# EAGLE design BRD171031 (EAGLE 8.2.2)
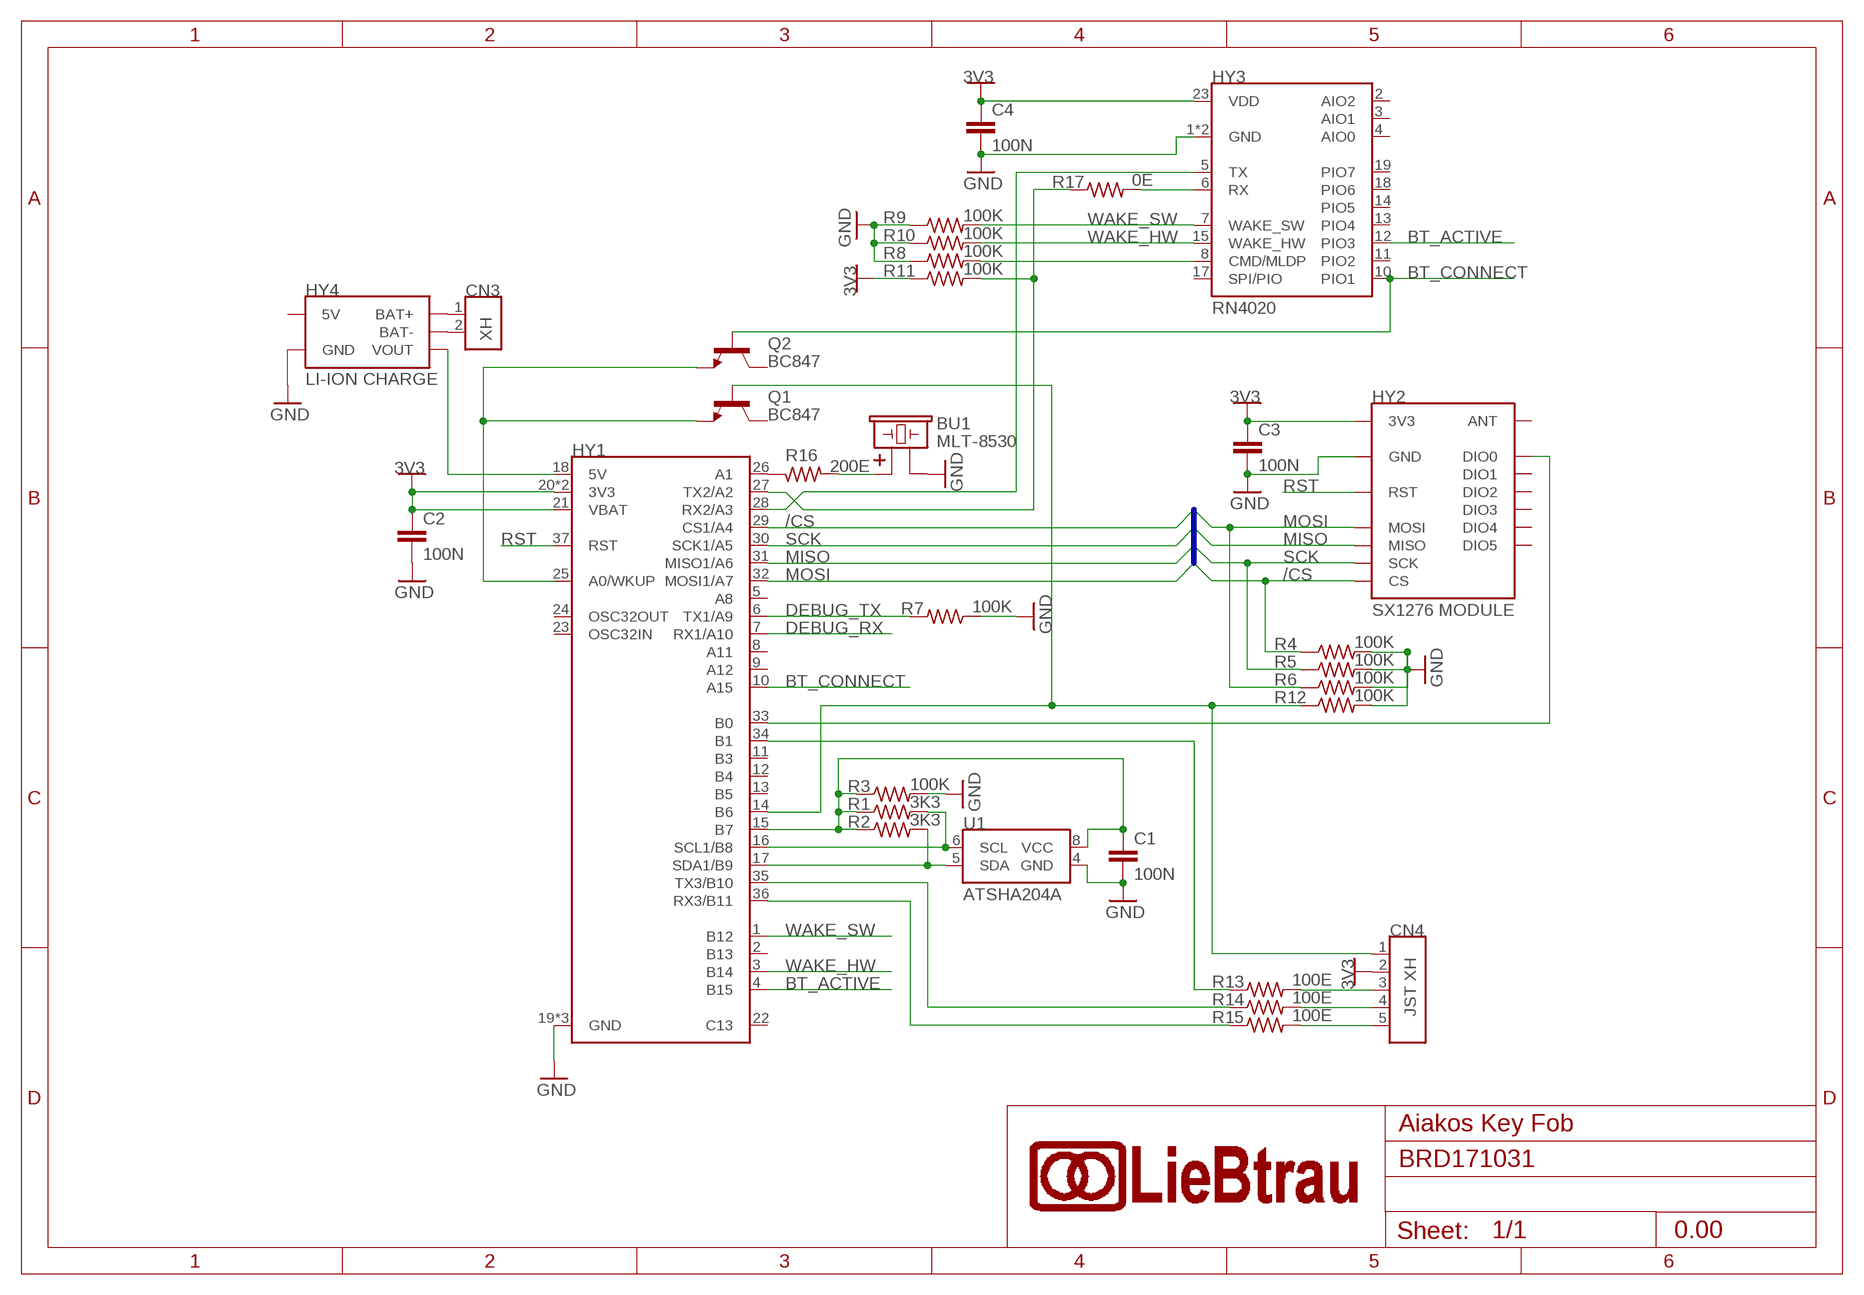
[diagram p0: schematic, sheet 1]
U$1 (SY_FRAMEA4): REV: 0.00; TITLE: Aiakos Key Fob

## Parts
BU1  MLT-8530  BU_B2P_8530_8530  [BU_8530]
C1  100N  CA_100N_1206  [CA_1206]
C2  100N  CA_100N_1206  [CA_1206]
C3  100N  CA_100N_1206  [CA_1206]
C4  100N  CA_100N_1206  [CA_1206]
CN3  XH  CN_2P_JST_B2B-XH_JST_B2B-XH  [CN_HDR_1X2_180D_P25_JST_B2B-XH]
CN4  JST XH  CN_5P_JST_B5B-XH_JST_B5B-XH  [CN_HDR_1X5_180D_P25_JST_B5B-XH]
HY1  HY_DEVBRD_BLUEPILL  [HY_DEVBRD_BLUEPILL_SMD]
HY2  SX1276 MODULE  HY_SX1276  [HY_SX1276]
HY3  RN4020  HY_RF_BLE_RN4020  [HY_BLE_RN4020]
HY4  LI-ION CHARGE  HY_PMMOD_LIION_TP4056__TP4056_  [HY_PMMOD_LIION]
Q1  BC847  TR_NPN_BC847_SOT23  [SC_SOT23]
Q2  BC847  TR_NPN_BC847_SOT23  [SC_SOT23]
R1  3K3  RE_3K3_1206  [RE_1206]
R2  3K3  RE_3K3_1206  [RE_1206]
R3  100K  RE_100K_1206  [RE_1206]
R4  100K  RE_100K_1206  [RE_1206]
R5  100K  RE_100K_1206  [RE_1206]
R6  100K  RE_100K_1206  [RE_1206]
R7  100K  RE_100K_1206  [RE_1206]
R8  100K  RE_100K_1206  [RE_1206]
R9  100K  RE_100K_1206  [RE_1206]
R10  100K  RE_100K_1206  [RE_1206]
R11  100K  RE_100K_1206  [RE_1206]
R12  100K  RE_100K_1206  [RE_1206]
R13  100E  RE_100E_1206  [RE_1206]
R14  100E  RE_100E_1206  [RE_1206]
R15  100E  RE_100E_1206  [RE_1206]
R16  200E  RE_200E_1206  [RE_1206]
R17  0E  RE_0E_1206  [RE_1206]
U1  ATSHA204A  IC_SPEC_ATSHA204A_ATSHA204A__SO8  [SC_SO08]

## Nets
3V3: C2.1 C3.1 C4.1 CN4.2 HY1.20(3V3) HY1.21(VBAT) HY1.38(3V3) HY2.VCC(3V3) HY3.23(VDD) R11.1
/CS: HY1.29(CS1/A4) HY2.NSS(CS) R4.1
BT_ACTIVE: HY1.4(B15) HY3.12(PIO3)
BT_CONNECT: HY1.10(A15) HY3.10(PIO1) Q2.1(B)
BTN: CN4.1 HY1.14(B6) Q1.1(B) R12.1
DEBUG_RX: HY1.7(RX1/A10)
DEBUG_TX: HY1.6(TX1/A9) R7.2
GND: BU1.2 C1.2 C2.2 C3.2 C4.2 HY1.19(GND) HY1.39(GND) HY1.40(GND) HY2.GND HY2.GND@1(GND) HY2.GND@2(GND) HY3.1(GND) HY3.24(GND) HY4.GND1(GND) HY4.GND2(GND) R3.2 R4.2 R5.2 R6.2 R7.1 R8.1 R9.1 R10.1 R12.2 U1.4(GND)
MISO: HY1.31(MISO1/A6) HY2.MISO
MOSI: HY1.32(MOSI1/A7) HY2.MOSI R6.1
N$1: HY3.6(RX) R17.2
N$4: HY1.33(B0) HY2.DIO0
N$5: HY1.27(TX2/A2) R11.2 R17.1
N$7: HY1.28(RX2/A3) HY3.5(TX)
N$9: HY3.8(CMD/MLDP) R8.2
N$10: HY1.36(RX3/B11) R15.1
N$11: HY1.35(TX3/B10) R14.1
N$12: HY1.34(B1) R13.1
N$14: HY1.25(A0/WKUP) Q1.2(E) Q2.2(E)
N$15: HY1.26(A1) R16.1
N$16: CN4.3 R13.2
N$17: CN4.4 R14.2
N$18: CN4.5 R15.2
N$19: BU1.1 R16.2
N$20: HY1.18(5V) HY4.OUT+(VOUT)
N$21: CN3.1 HY4.B+(BAT+)
N$22: CN3.2 HY4.B-(BAT-)
PWR_U1: C1.1 HY1.15(B7) R1.1 R2.1 R3.1 U1.8(VCC)
RST: HY1.37(RST) HY2.REST(RST)
SCK: HY1.30(SCK1/A5) HY2.SCK R5.1
SCL: HY1.16(SCL1/B8) R1.2 U1.6(SCL)
SDA: HY1.17(SDA1/B9) R2.2 U1.5(SDA)
WAKE_HW: HY1.3(B14) HY3.15(WAKE_HW) R10.2
WAKE_SW: HY1.1(B12) HY3.7(WAKE_SW) R9.2
Unconnected: HY1.2(B13) HY1.5(A8) HY1.8(A11) HY1.9(A12) HY1.11(B3) HY1.12(B4) HY1.13(B5) HY1.22(C13) HY1.23(OSC32IN) HY1.24(OSC32OUT) HY2.ANT HY2.DIO1 HY2.DIO2 HY2.DIO3 HY2.DIO4 HY2.DIO5 HY3.2(AIO2) HY3.3(AIO1) HY3.4(AIO0) HY3.11(PIO2) HY3.13(PIO4) HY3.14(PIO5) HY3.17(SPI/PIO) HY3.18(PIO6) HY3.19(PIO7) HY4.5V Q1.3(C) Q2.3(C)

## Buses
/CS,SCK,MISO,MOSI

## Library data of the parts
BU1 = lieBtrau:BU_B2P; COST: 2.29; ORDERCODE: 668-1479-1-ND
C1-C4 = lieBtrau:CA; COST: 0.09; ORDERCODE: 399-1249-1-ND
CN3 = lieBtrau:CN_2P; COST: 0.13; ORDERCODE: 455-2247-ND
CN4 = lieBtrau:CN_5P; COST: 0.21; ORDERCODE: 455-2270-ND
HY1 = lieBtrau:HY_DEVBRD_BLUEPILL
HY2 = lieBtrau:HY_SX1276: Order from AliExpress <https://www.aliexpress.com/item/2-pcs-LOra-Spreading-High-Sensitivity-XL1276-D01-XS1278-Wireless-Transceiver-Module-433MHz/32322666735.html>; COST: 7.28; ORDERCODE: AliExpress
HY3 = lieBtrau:HY_RF_BLE_RN4020; COST: 8.57; ORDERCODE: RN4020-V/RM123-ND
HY4 = lieBtrau:HY_PMMOD_LIION; COST: 0.28; ORDERCODE: AliExpress
Q1 Q2 = lieBtrau:TR_NPN; COST: 0.12; ORDERCODE: 568-1636-1-ND
R1 R2 = lieBtrau:RE: Yageo RC1206 Stackpole RMCF1206; COST: 0.09; ORDERCODE: 311-3.30KFRCT-ND
R3-R12 = lieBtrau:RE: Yageo RC1206 Stackpole RMCF1206; COST: 0.09; ORDERCODE: 311-100KFRCT-ND
R13-R15 = lieBtrau:RE: Yageo RC1206 Stackpole RMCF1206; COST: 0.09; ORDERCODE: 311-100FRCT-ND
R16 = lieBtrau:RE: Yageo RC1206 Stackpole RMCF1206; COST: 0.09; ORDERCODE: 311-200FRCT-ND
R17 = lieBtrau:RE: Yageo RC1206 Stackpole RMCF1206; COST: 0.09; ORDERCODE: 311-0.0ERCT-ND
U1 = lieBtrau:IC_SPEC_ATSHA204A; COST: 0.49; ORDERCODE: ATSHA204A-SSHDA-TCT-ND

## Board
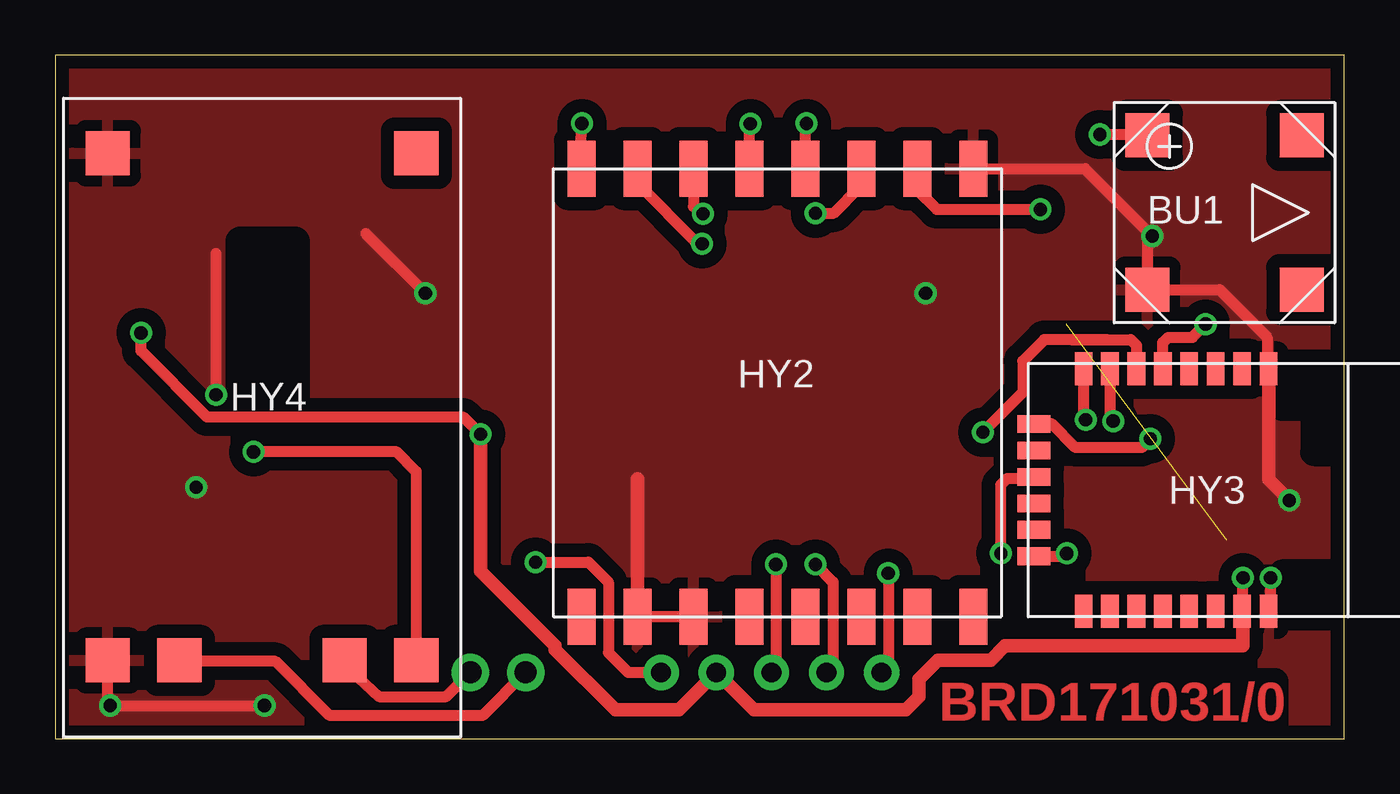
[diagram p1: board, top side]
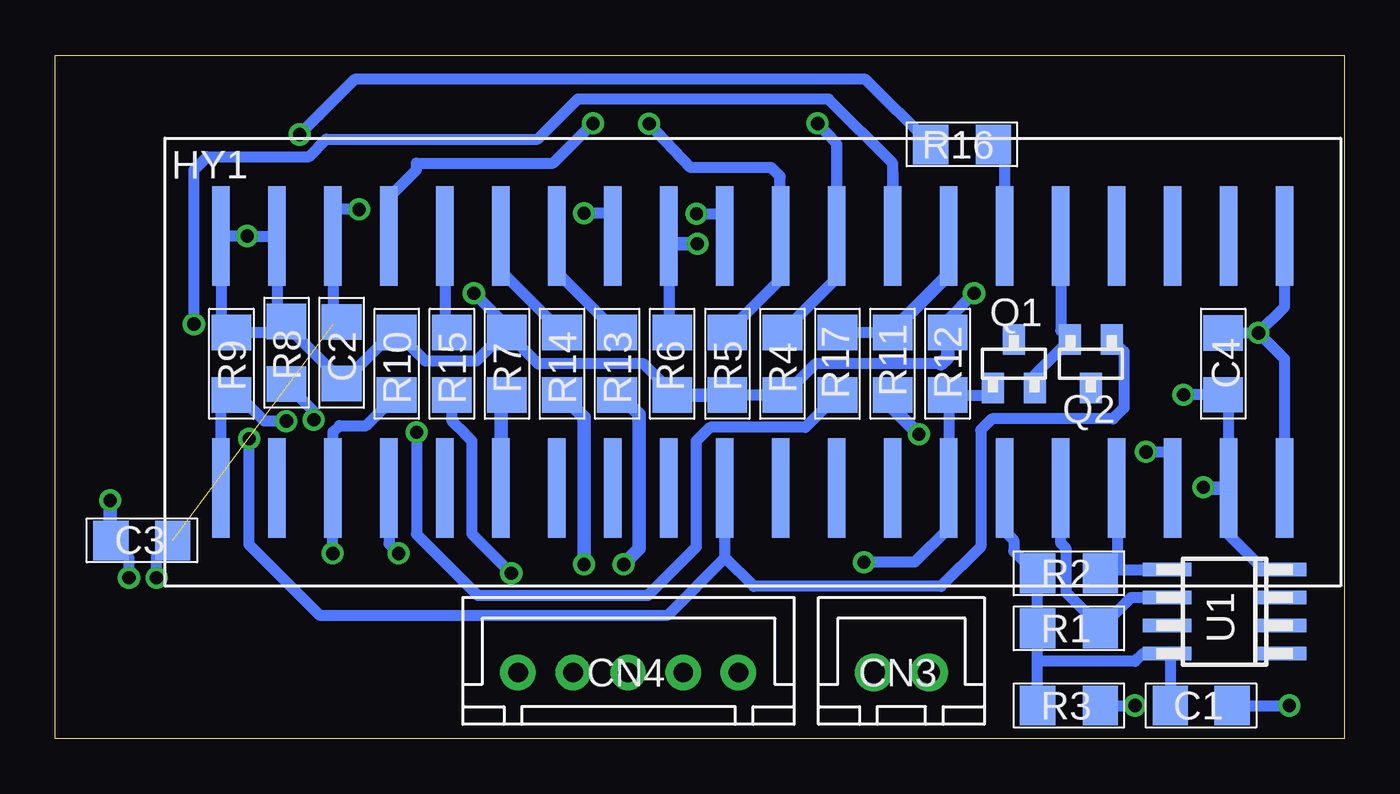
[diagram p2: board, bottom side, seen from below]

Size 58.5 x 31 mm. Coordinates in mm from the lower left corner, seen from the top.
Outline: 0,0 58.5,0 58.5,31 0,31 0,0
Copper layers (1*16): Top 0.035mm / dielectric 1.5mm / Bottom 0.035mm
Design rules "dtron": minimum track width 0.175mm, minimum drill 0.6mm, track to track 0.25mm, track to pad 0.25mm, pad to pad 0.2mm, via to via 0.25mm, smd to smd 0.2mm, copper to edge 0.5mm, drill to drill 0.2mm, minimum pad ring 0.25mm, minimum via ring 0.2mm, stop-mask expansion 0.1mm, vias tented up to drill 0mil, thermal gap 0.5mm

### Footprints (pad centres in the part's own frame; a part is rotated, then mirrored left to right if it is on the bottom)
BU_8530 = smd 2 x 2: 1 -3.5,3.5; 2 -3.5,-3.5; 3 3.5,-3.5; 4 3.5,3.5
CA_1206 = smd 1.6 x 1.8: 1 -1.4,0; 2 1.4,0
CN_HDR_1X2_180D_P25_JST_B2B-XH = drill 1 pad 1.7: 1 -1.25,0; 2 1.25,0
CN_HDR_1X5_180D_P25_JST_B5B-XH = drill 0.9 pad 1.6: 1 -5,0; 2 -2.5,0; 3 0,0; 4 2.5,0; 5 5,0
HY_DEVBRD_BLUEPILL_SMD = smd 4.5 x 0.8: 1 -5.715,20.32; 2 -5.715,17.78; 3 -5.715,15.24; 4 -5.715,12.7; 5 -5.715,10.16; 6 -5.715,7.62; 7 -5.715,5.08; 8 -5.715,2.54; 9 -5.715,0; 10 -5.715,-2.54; 11 -5.715,-5.08; 12 -5.715,-7.62; 13 -5.715,-10.16; 14 -5.715,-12.7; 15 -5.715,-15.24; 16 -5.715,-17.78; 17 -5.715,-20.32; 18 -5.715,-22.86; 19 -5.715,-25.4; 20 -5.715,-27.94; 21 5.715,-27.94; 22 5.715,-25.4; 23 5.715,-22.86; 24 5.715,-20.32; 25 5.715,-17.78; 26 5.715,-15.24; 27 5.715,-12.7; 28 5.715,-10.16; 29 5.715,-7.62; 30 5.715,-5.08; 31 5.715,-2.54; 32 5.715,0; 33 5.715,2.54; 34 5.715,5.08; 35 5.715,7.62; 36 5.715,10.16; 37 5.715,12.7; 38 5.715,15.24; 39 5.715,17.78; 40 5.715,20.32
HY_SX1276 = smd 2.54 x 1.27: ANT -10.16,8.89; DIO0 10.16,-3.81; DIO1 -10.16,1.27; DIO2 -10.16,-1.27; DIO3 -10.16,-3.81; DIO4 -10.16,-6.35; DIO5 -10.16,-8.89; GND 10.16,-8.89; GND@1 -10.16,6.35; GND@2 -10.16,3.81; MISO 10.16,3.81; MOSI 10.16,6.35; NSS 10.16,8.89; REST 10.16,-1.27; SCK 10.16,1.27; VCC 10.16,-6.35
HY_BLE_RN4020 = smd 1.5 x 0.8: 1 0.25,10.9; 2 0.25,9.7; 3 0.25,8.5; 4 0.25,7.3; 5 0.25,6.1; 6 0.25,4.9; 7 0.25,3.7; 8 0.25,2.5; 17 11.25,2.5; 18 11.25,3.7; 19 11.25,4.9; 20 11.25,6.1; 21 11.25,7.3; 22 11.25,8.5; 23 11.25,9.7; 24 11.25,10.9 | smd 0.8 x 1.5: 10 2.75,0.25; 11 3.95,0.25; 12 5.15,0.25; 13 6.35,0.25; 14 7.55,0.25; 15 8.75,0.25
HY_PMMOD_LIION = smd 2 x 2: 5V -12,6.5; B+ 11,3.25; B- 11,-4.25; GND1 -12,-7.5; GND2 11,-7.5; OUT+ 11,6.5
SC_SOT23 = smd 1 x 1.4: 1 -0.95,-1.1; 2 0.95,-1.1; 3 0,1.1
RE_1206 = smd 1.6 x 1.803: 1 -1.422,0; 2 1.422,0
SC_SO08 = smd 0.6 x 2.2: 1 -1.905,-2.6; 2 -0.635,-2.6; 3 0.635,-2.6; 4 1.905,-2.6; 5 1.905,2.6; 6 0.635,2.6; 7 -0.635,2.6; 8 -1.905,2.6

### Placement (x,y rotation side)
BU1  53.06,23.86 0 top
C1  6.5,1.5 0 bottom
C2  45.5,17.5 270 bottom
C3  54.56,8.99 180 bottom
C4  5.5,17 270 bottom
CN3  20.1,3 180 bottom
CN4  32.5,3 180 bottom
HY1  30.65,17.08 90 bottom
HY2  32.77,15.69 90 top
HY3  44.16,17.02 270 top
HY4  9.89,14.55 270 top
Q1  15,17 0 bottom
Q2  11.5,17 180 bottom
R1  12.5,5 0 bottom
R2  12.5,7.5 0 bottom
R3  12.5,1.5 0 bottom
R4  25.5,17 270 bottom
R5  28,17 270 bottom
R6  30.5,17 270 bottom
R7  38,17 270 bottom
R8  48,17.5 270 bottom
R9  50.5,17 270 bottom
R10  43,17 270 bottom
R11  20.5,17 90 bottom
R12  18,17 90 bottom
R13  33,17 270 bottom
R14  35.5,17 270 bottom
R15  40.5,17 270 bottom
R16  17.35,26.95 180 bottom
R17  23,17 270 bottom
U1  5.44,5.76 90 bottom
U$2  [MC_FRAME_A5]  -65.11,-59.3 0 top  (outside the outline)

### Tracks (layer width: path | path; a pad name or v marks a point on that pad's centre or on a via)
3V3  (via drill 0.6)  (1 unrouted)
  Top 0.508: v3.9,18.4 3.9,17.58 6.88,14.6 18.5,14.6 v19.3,13.8 | HY2.VCC 39.12,24.88 40,24 v44.7,24 | HY3.23 53.9,5.81 v53.9,7.3 | 30.15,3.15 CN4.2
  Top 0.61: v19.3,13.8 19.3,7.6 22.69,4.21 22.69,4.03 25.42,1.3 28.3,1.3 CN4.2 31.7,1.3 38.6,1.3 39.2,1.9 39.2,2.69 40.05,3.54 40.05,3.55 | 53.9,5.81 53.9,4.2 43.1,4.2 42.45,3.55 40.5,3.55 | 40.5,3.55 40.05,3.55 | 40.5,3.55 40.05,3.55
  Bottom 0.508: HY1.20 2.71,17.21 v3.9,18.4 | C4.1 v3.9,18.4 | v3.9,18.4 2.71,19.59 HY1.21 | C2.1 arc90 45.89,18.79 HY1.38 45.9,22.8 45.9,24 v44.7,24 | v53.9,7.3 53.9,8.25 C3.1
  Bottom 0.61: R11.1 20.5,15 v19.3,13.8
/CS  (via drill 0.6)
  Top 0.508: 24,26.5 24,25.97 HY2.NSS arc90 23.73,26 v23.9,27.9
  Bottom 0.508: v23.9,27.9 23.03,26.97 HY1.29 23.03,20.89 R4.1
BT_ACTIVE  (via drill 0.6)
  Top 0.508: v42.91,8.4 42.91,11.51 43.2,11.8 44.34,11.8 HY3.12
  Bottom 0.508: HY1.4 43.35,8.84 v42.91,8.4
BT_CONNECT  (via drill 0.6)
  Top 0.508: v49.7,13.6 49.3,13.2 46.3,13.2 45.23,14.27 HY3.10
  Bottom 0.508: Q2.1 10,17.55 10,15 10.5,14.5 16,14.5 16.5,14 16.5,8.7 18.3,6.9 26.8,6.9 28.1,8.2 | 28.1,8.2 HY1.10 | 28.1,8.2 30.7,5.6 46.5,5.6 49.7,8.8 v49.7,13.6
BTN  (via drill 0.6)
  Top 0.508: CN4.1 26,3 25.1,3.9 25.1,7.1 24.2,8 v21.8,8
  Bottom 0.508: Q1.1 16.27,15.58 R12.1 17.95,15.53 HY1.14 17.95,9.55 19.5,8 v21.8,8
DEBUG_TX
  Bottom 0.508: R7.2 38.27,15.31
  Bottom 0.61: 38.27,15.31 HY1.6
GND  (via drill 0.6)
  Top 0.508: HY4.GND2 2.39,1.61 v2.5,1.5 v9.5,1.5 | HY2.GND@2 HY2.GND@1 | v7.3,15.6 7.3,22 | 14.1,22.9 v16.8,20.2 | HY3.1 55,16.83 55,18.2 52.84,20.36 BU1.2 49.56,22.8 v49.78,22.8 46.73,25.85 HY2.GND | HY3.24 55.15,5.86 v55.15,7.3
  Top 0.61: HY2.GND@1 26.42,11.78 | HY3.1 55.06,11.74 v56,10.8
  Bottom 0.508: U1.4 3.66,7.67 5.25,9.25 HY1.19 5.25,15.35 arc-90 C4.2 v7.3,15.6 | R3.2 v9.5,1.5 | C1.2 v2.5,1.5 | R12.2 18,19 v16.8,20.2 | R8.1 48.43,18.85 HY1.39 v49.78,22.8 HY1.40 50.97,18.89 R9.1 48.5,18.42 R8.1 | 45.6,15.6 C2.2 45.44,16.16 | R6.2 30.5,15.7 31.8,17 36.58,17 R7.1 | R7.1 38.09,18.42 39.39,17.12 41.7,17.12 R10.1 43,18.3 43.3,18.3 45.44,16.16 | C3.2 55.15,8.18 v55.15,7.3 | 18.3,17 24,17 25.42,15.58 R5.2 | R8.1 48,18.72 45.44,16.16 | R7.1 38,18.7 v39.5,20.2
  Bottom 0.61: R12.2 18,17.3 18.3,17 | R5.2 R6.2 | R4.2 25.42,15.58 | HY1.19 6.27,11.37 v6.4,11.4 | v56,10.8 56,9.03 C3.2
  pour Top (isolate 0.61): -3.1,32.1 -3.1,-3.7 68.1,-3.7 68.1,32.1
MISO  (via drill 0.6)
  Top 0.508: HY2.MISO 28.96,24.14 v29.4,23.8
  Bottom 0.508: v29.4,23.8 28.3,23.8 28.1,22.8 HY1.31
MOSI  (via drill 0.6)
  Top 0.508: v29.36,22.45 29.15,22.45 26.42,25.18 HY2.MOSI
  Bottom 0.508: R6.1 30.65,18.42 30.65,22.48 HY1.32
  Bottom 0.61: v29.36,22.45 30.62,22.45 30.65,22.48
N$1  (via drill 0.6)
  Top 0.508: HY3.6 49.06,17.84 48.8,18.1 46.6,18.1 | 46.1,18.1 46.6,18.1 | v42.1,13.9 43.91,15.71 43.91,17.12 44.88,18.1 46.6,18.1 | 47.7,18.1 46.6,18.1
  Bottom 0.508: R17.2 24.46,14.12 28.78,14.12 29.4,13.5 29.4,8.7 31.6,6.5 39.33,6.5 42.1,9.27 v42.1,13.9
N$4  (via drill 0.6)
  Top 0.508: v34.5,23.83 35.33,23.83 36.5,25 36.5,25.77 HY2.DIO0
  Bottom 0.508: HY1.33 33.19,23.83 v34.5,23.83
N$5
  Bottom 0.508: R17.1 R11.2
  Bottom 0.61: R11.2 20.5,18.5 17.95,21.05 HY1.27
N$7  (via drill 0.6)
  Top 0.508: HY3.5 50.26,17.96 50.5,18.2 51.6,18.2 v52.2,18.8
  Bottom 0.508: 20.49,25.69 HY1.28 20.49,26.09 23.4,29 34.79,29 36.6,27.19 46.19,27.19 46.98,26.4 51.6,26.4 52.2,25.8 v52.2,18.8
N$9  (via drill 0.6)
  Top 0.508: HY3.8 46.66,14.56 v46.76,14.46
  Bottom 0.508: v46.76,14.46 46.76,14.84 R8.2
N$10
  Bottom 0.508: HY1.36 40.81,18.42 R15.1
N$11
  Bottom 0.508: R14.1 38.27,21.19 HY1.35
N$12
  Bottom 0.508: HY1.34 35.73,21.15 R13.1
N$14
  Bottom 0.508: Q1.2 14.05,16.5 Q2.2 | Q2.2 | HY1.25 12.87,18.51 Q2.2
N$15
  Bottom 0.508: HY1.26 15.41,26.95 R16.1
N$16  (via drill 0.6)
  Top 0.508: v32.7,7.9 32.7,3.2
  Top 0.61: 32.7,3.2 CN4.3
  Bottom 0.61: R13.2 32.88,15.58 32,14.7 32,8.6 v32.7,7.9
N$17  (via drill 0.6)
  Top 0.508: v34.5,7.9 35.3,7.1 35.3,3.3 CN4.4
  Top 0.61: CN4.4 35.3,3.3
  Bottom 0.61: R14.2 34.5,14.58 v34.5,7.9
N$18  (via drill 0.6)
  Top 0.508: v37.8,7.5 37.8,3.3 CN4.5
  Bottom 0.508: R15.2 40.5,14.42 39.91,13.82 39.91,13.81 39.6,13.5 39.6,9.3 v37.8,7.5
N$19  (via drill 0.6)
  Top 0.508: v47.4,27.4 49.52,27.4 BU1.1
  Bottom 0.508: 46.55,28.25 v47.4,27.4 44.9,29.9 21.72,29.9 R16.2
N$20  (via drill 0.6)
  Top 0.508: HY4.OUT+ 16.39,12.11 15.5,13 v9,13
  Bottom 0.508: v9,13 8,13 7.79,12.79 HY1.18
N$21
  Top 0.508: HY4.B+ 13.14,3.36 14.7,1.9 17.75,1.9 CN3.1
N$22
  Top 0.508: CN3.2 19.39,1.04 12.46,1.04 10,3.5 5.69,3.5 HY4.B-
PWR_U1
  Bottom 0.508: C1.1 7.9,3.71 U1.8 9.14,3.85 9.5,3.5 13.8,3.5 13.92,3.38 | HY1.15 15.41,9.41 15,9 15,8.5 13.92,7.42 R1.1 13.92,3.38 | R3.1 13.92,3.38
  Bottom 0.61: R2.1 13.92,7.42
RST  (via drill 0.6)
  Top 0.508: HY2.REST 34.04,27.75 v34.09,27.9
  Bottom 0.508: HY1.37 43.35,24.55 42.1,25.8 42.1,26.1 35.9,26.1 v34.09,27.9
SCK  (via drill 0.6)
  Top 0.508: 31.17,26.18 HY2.SCK 31.5,27.74 v31.55,27.88
  Bottom 0.508: HY1.30 25.6,22.82 | R5.1 25.6,20.82 25.6,22.82 | v31.55,27.88 29.66,25.9 26,25.9 25.6,25.5 25.6,22.82
SCL
  Bottom 0.508: U1.6 9.68,6.39 R1.2 11.08,5.5 11.5,5.5 12.62,6.62 12.62,8.61 12.87,8.86 HY1.16
SDA
  Bottom 0.508: 10.3,7.67 U1.5 | 10.3,7.67 11.08,7.67 R2.2 | HY1.17 10.3,11.37 10.3,7.67
WAKE_HW  (via drill 0.6)
  Top 0.508: HY3.15 45.77,8.27 v45.9,8.4
  Bottom 0.508: v45.9,8.4 HY1.3 45.89,13.91 45.6,14.2 44.38,14.2 R10.2
WAKE_SW  (via drill 0.6)
  Top 0.508: HY3.7 47.86,14.55 v48.01,14.4
  Bottom 0.508: v48.01,14.4 49,14.4 49.9,15.3 50.22,15.3 R9.2 50.97,15.11 HY1.1

### Text on the board
Top: BRD171031/0